# EAGLE design pid driver (EAGLE 9.5.1)

## Sheet 1 of 2
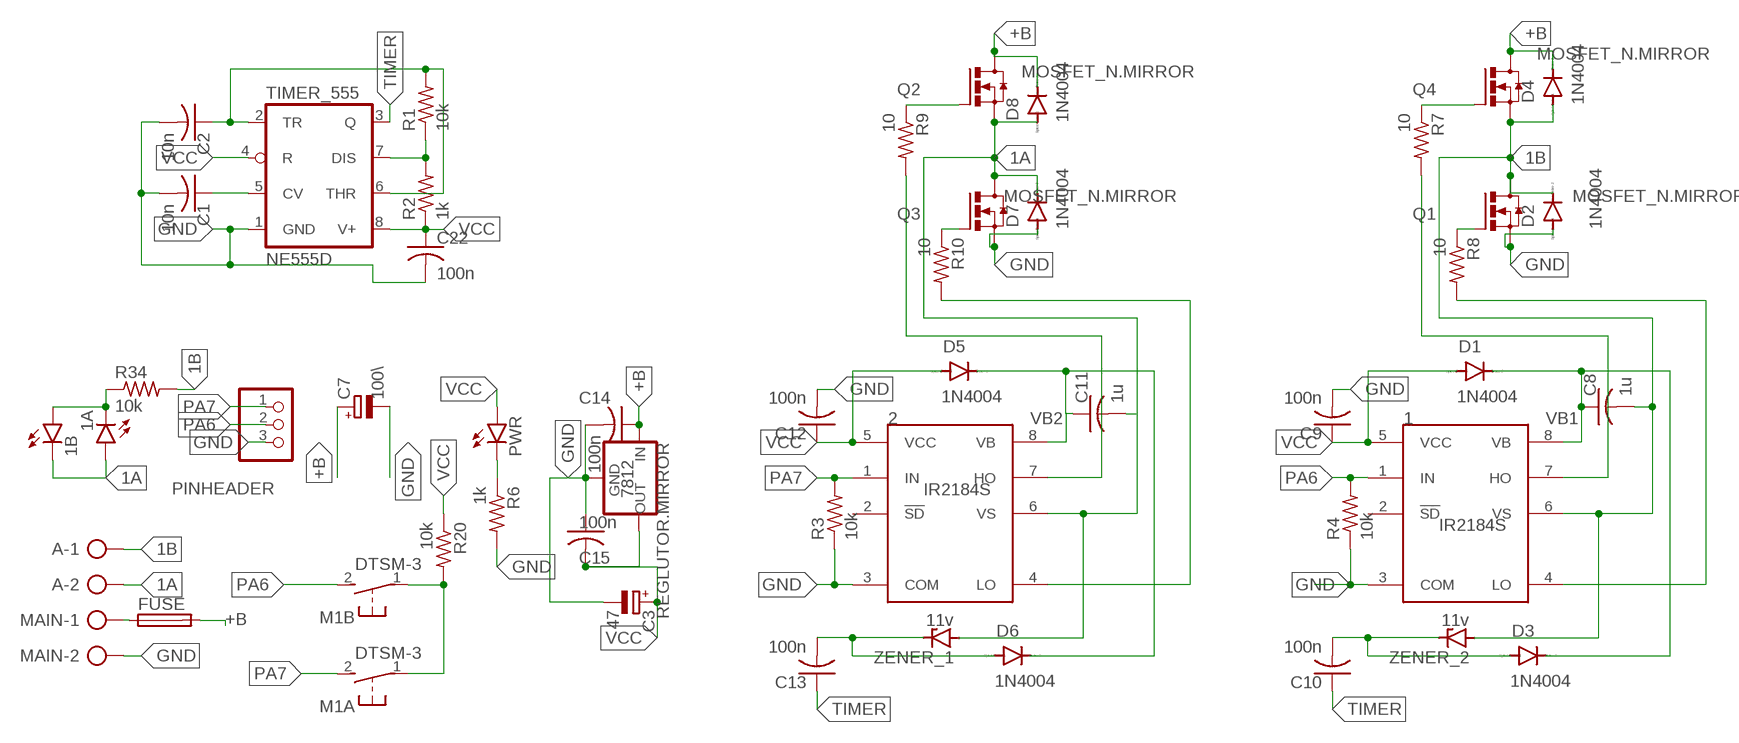
[diagram p0: schematic, sheet 1]

### Parts
1  IR2184S  [SO08]
1A  LEDCHIPLED_1206  [CHIPLED_1206]
1B  LEDCHIPLED_1206  [CHIPLED_1206]
2  IR2184S  [SO08]
7812  REGLUTOR.MIRROR  [78XXL.MIRROR]
A  AK300/22  [XTALRR488W60L1090T465H350B]
C1  10n  C-USC1206K  [C1206K]
C2  10n  C-USC1206K  [C1206K]
C3  47  CPOL-EUE5-10.5  [E5-10,5]
C7  100\  CPOL-EUE5-10.5  [E5-10,5]
C8  1u  C-USC1206K  [C1206K]
C9  100n  C-USC1206K  [C1206K]
C10  100n  C-USC1206K  [C1206K]
C11  1u  C-USC1206K  [C1206K]
C12  100n  C-USC1206K  [C1206K]
C13  100n  C-USC1206K  [C1206K]
C14  100n  C-USC1206K  [C1206K]
C15  100n  C-USC1206K  [C1206K]
C22  100n  C-USC1206K  [C1206K]
D1  1N4004  [DO41-10]
D2  1N4004  [DO41-10]
D3  1N4004  [DO41-10]
D4  1N4004  [DO41-10]
D5  1N4004  [DO41-10]
D6  1N4004  [DO41-10]
D7  1N4004  [DO41-10]
D8  1N4004  [DO41-10]
FUSE  FUSE_HOLDER  [SH22,5A]
M1A  DTSM-3  [DTSM-3]
M1B  DTSM-3  [DTSM-3]
MAIN  AK300/22  [XTALRR488W60L1090T465H350B]
PINHEADER  PINHD-1X3  [1X03]
PWR  LEDCHIPLED_1206  [CHIPLED_1206]
Q1  MOSFET_N.MIRROR  [TO220.MIRROR]
Q2  MOSFET_N.MIRROR  [TO220.MIRROR]
Q3  MOSFET_N.MIRROR  [TO220.MIRROR]
Q4  MOSFET_N.MIRROR  [TO220.MIRROR]
R1  10k  R-US_M1206  [M1206]
R2  1k  R-US_M1206  [M1206]
R3  10k  R-US_M1206  [M1206]
R4  10k  R-US_M1206  [M1206]
R6  1k  R-US_M1206  [M1206]
R7  10  R-US_M1206  [M1206]
R8  10  R-US_M1206  [M1206]
R9  10  R-US_M1206  [M1206]
R10  10  R-US_M1206  [M1206]
R20  10k  R-US_M1206  [M1206]
R34  10k  R-US_M1206  [M1206]
TIMER_555  NE555D  [SO08]
ZENER_1  11v  BZD23  [SOD81]
ZENER_2  11v  BZD23  [SOD81]

### Nets
1A: 1A.A 1B.C 2.6(VS) A.2 C11.2 D7.C D8.A Q2.S Q3.D ZENER_1.A
1B: 1.6(VS) A.1 C8.2 D2.C D4.A Q1.D Q4.S R34.2 ZENER_2.A
+B: 7812.IN C7.+ C14.1 D4.C D8.C FUSE.2 Q2.D Q4.D
GND: 1.3(COM) 2.3(COM) 7812.GND C1.2 C2.2 C3.- C7.- C9.2 C12.2 C14.2 C15.1 C22.2 D2.A D7.A MAIN.2 PINHEADER.3 Q1.S Q3.S R3.1 R4.1 R6.2 TIMER_555.1(GND) ; also sheet 2
N$1: PWR.C R6.1
N$2: C1.1 TIMER_555.5(CV)
N$3: R1.1 R2.2 TIMER_555.7(DIS)
N$4: C2.1 R1.2 TIMER_555.2(TR) TIMER_555.6(THR)
N$7: M1A.1 M1B.1 R20.2
N$9: Q4.G R7.1
N$10: Q1.G R8.1
N$12: 1.4(LO) R8.2
N$13: 1.7(HO) R7.2
N$14: C10.2 D3.A ZENER_2.C
N$15: Q3.G R10.1
N$16: Q2.G R9.1
N$17: 2.4(LO) R10.2
N$18: 2.7(HO) R9.2
N$20: C13.2 D6.A ZENER_1.C
N$22: FUSE.1 MAIN.1
N$45: 1A.C 1B.A R34.1
PA6: 1.1(IN) M1B.2 PINHEADER.2 R4.2
PA7: 2.1(IN) M1A.2 PINHEADER.1 R3.2
TIMER: C10.1 C13.1 TIMER_555.3(Q)
VB1: 1.8(VB) C8.1 D1.C D3.C
VB2: 2.8(VB) C11.1 D5.C D6.C
VCC: 1.5(VCC) 2.5(VCC) 7812.OUT C3.+ C9.1 C12.1 C15.2 C22.1 D1.A D5.A PWR.A R2.1 R20.1 TIMER_555.4(R) TIMER_555.8(V+)
Unconnected: 1.2(!SD) 2.2(!SD)

## Sheet 2 of 2
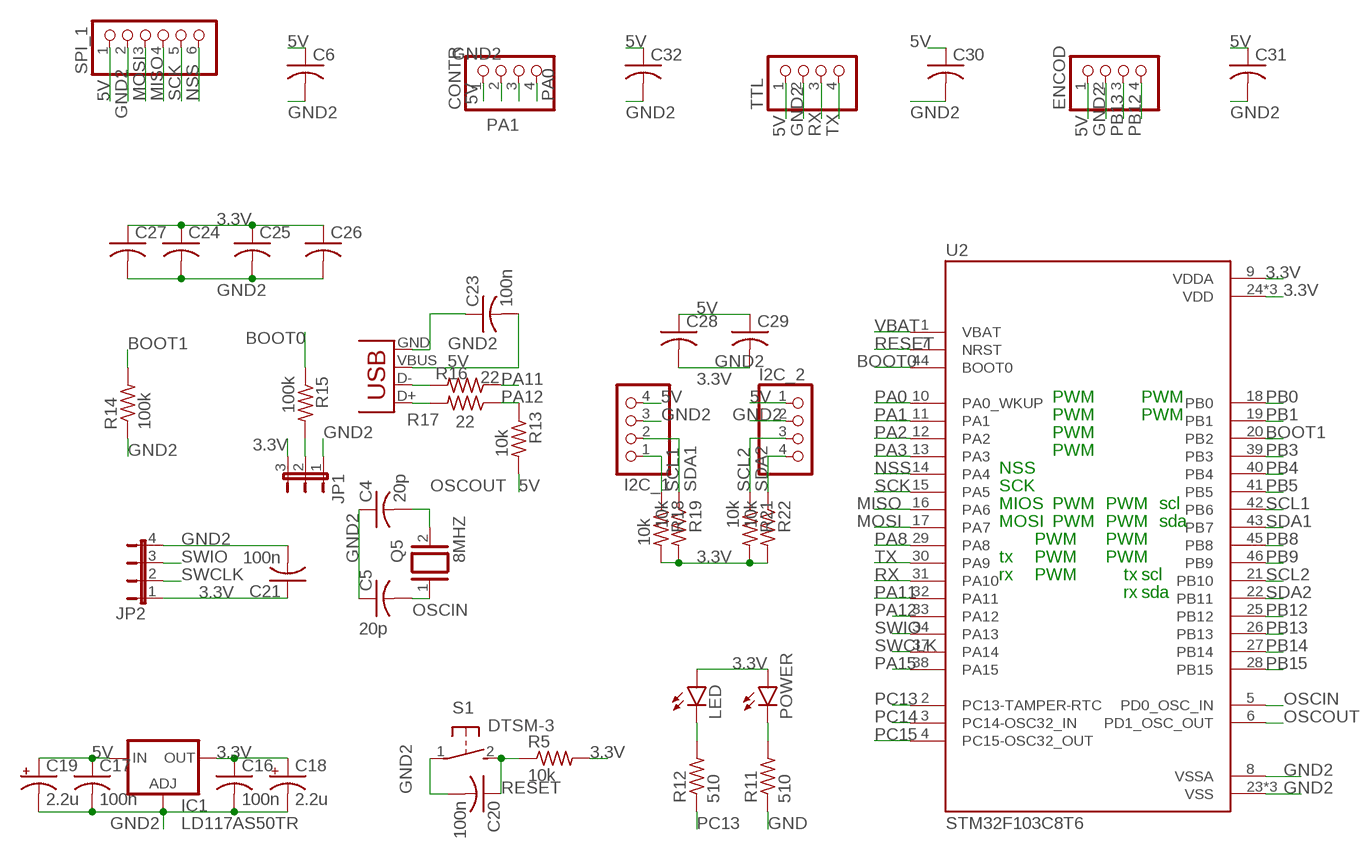
[diagram p1: schematic, sheet 2]

### Parts
C4  20p  C-USC1206  [C1206]
C5  20p  C-USC1206  [C1206]
C6  C-USC1206  [C1206]
C16  100n  C-USC1206  [C1206]
C17  100n  C-USC1206  [C1206]
C18  2.2u  CPOL-USE2-5  [E2-5]
C19  2.2u  CPOL-USE2-5  [E2-5]
C20  100n  C-USC1206  [C1206]
C21  100n  C-USC1206  [C1206]
C23  100n  C-USC1206  [C1206]
C24  C-USC1206  [C1206]
C25  C-USC1206  [C1206]
C26  C-USC1206  [C1206]
C27  C-USC1206  [C1206]
C28  C-USC1206  [C1206]
C29  C-USC1206  [C1206]
C30  C-USC1206  [C1206]
C31  C-USC1206  [C1206]
C32  C-USC1206  [C1206]
CONTR  PINHD-1X4  [1X04]
ENCOD  PINHD-1X4  [1X04]
I2C_1  PINHD-1X4  [1X04]
I2C_2  PINHD-1X4  [1X04]
IC1  LD117AS50TR  [SOT223]
JP1  JP2E  [JP2]
JP2  JP4E  [JP4]
LED  LEDCHIPLED_1206  [CHIPLED_1206]
POWER  LEDCHIPLED_1206  [CHIPLED_1206]
Q5  8MHZ  XTAL/S  [QS]
R5  10k  R-US_R1206  [R1206]
R11  510  R-US_R1206  [R1206]
R12  510  R-US_R1206  [R1206]
R13  10k  R-US_R1206  [R1206]
R14  100k  R-US_R1206  [R1206]
R15  100k  R-US_R1206  [R1206]
R16  22  R-US_R1206  [R1206]
R17  22  R-US_R1206  [R1206]
R18  10k  R-US_R1206  [R1206]
R19  10k  R-US_R1206  [R1206]
R21  10k  R-US_R1206  [R1206]
R22  10k  R-US_R1206  [R1206]
S1  DTSM-3  [DTSM-3]
SPI_1  PINHD-1X6  [1X06]
TTL  PINHD-1X4  [1X04]
U2  STM32F103C8T6  [QFP50P900X900X160-48N]
X1  USB-MB-S  [USB-MB-S]

### Nets
3.3V: C16.1 C18.+ C21.1 C24.1 C25.1 C26.1 C27.1 IC1.4(OUT) JP1.3 JP2.1 LED.A POWER.A R5.2 R18.2 R19.2 R21.2 R22.2 U2.9(VDDA) U2.24(VDD) U2.36(VDD) U2.48(VDD)
5V: C6.1 C17.1 C19.+ C23.2 C28.1 C29.1 C30.1 C31.1 C32.1 CONTR.1 ENCOD.1 I2C_1.4 I2C_2.1 IC1.3(IN) R13.2 SPI_1.1 TTL.1 X1.VBUS
BOOT0: R15.1 U2.44(BOOT0)
BOOT1: R14.2 U2.20(PB2)
GND: R11.1 ; also sheet 1
GND2: C4.1 C5.1 C6.2 C16.2 C17.2 C18.- C19.- C20.2 C21.2 C23.1 C24.2 C25.2 C26.2 C27.2 C28.2 C29.2 C30.2 C31.2 C32.2 CONTR.2 ENCOD.2 I2C_1.3 I2C_2.2 IC1.1(ADJ) JP1.1 JP2.4 R14.1 S1.1 SPI_1.2 TTL.2 U2.8(VSSA) U2.23(VSS) U2.35(VSS) U2.47(VSS) X1.GND
MISO: SPI_1.4 U2.16(PA6)
MOSI: SPI_1.3 U2.17(PA7)
N$5: LED.C R12.2
N$6: POWER.C R11.2
N$8: JP1.2 R15.2
N$19: R16.2 X1.D-
N$21: R17.2 X1.D+
NSS: SPI_1.6 U2.14(PA4)
OSCIN: C5.2 Q5.1 U2.5(PD0_OSC_IN)
OSCOUT: C4.2 Q5.2 U2.6(PD1_OSC_OUT)
PA0: CONTR.4 U2.10(PA0_WKUP)
PA1: CONTR.3 U2.11(PA1)
PA2: U2.12(PA2)
PA3: U2.13(PA3)
PA8: U2.29(PA8)
PA11: R16.1 U2.32(PA11)
PA12: R13.1 R17.1 U2.33(PA12)
PA15: U2.38(PA15)
PB0: U2.18(PB0)
PB1: U2.19(PB1)
PB3: U2.39(PB3)
PB4: U2.40(PB4)
PB5: U2.41(PB5)
PB8: U2.45(PB8)
PB9: U2.46(PB9)
PB12: ENCOD.4 U2.25(PB12)
PB13: ENCOD.3 U2.26(PB13)
PB14: U2.27(PB14)
PB15: U2.28(PB15)
PC13: R12.1 U2.2(PC13-TAMPER-RTC)
PC14: U2.3(PC14-OSC32_IN)
PC15: U2.4(PC15-OSC32_OUT)
RESET: C20.1 R5.1 S1.2 U2.7(NRST)
RX: TTL.3 U2.31(PA10)
SCK: SPI_1.5 U2.15(PA5)
SCL1: I2C_1.1 R18.1 U2.42(PB6)
SCL2: I2C_2.3 R21.1 U2.21(PB10)
SDA1: I2C_1.2 R19.1 U2.43(PB7)
SDA2: I2C_2.4 R22.1 U2.22(PB11)
SWCLK: JP2.2 U2.37(PA14)
SWIO: JP2.3 U2.34(PA13)
TX: TTL.4 U2.30(PA9)
VBAT: U2.1(VBAT)

### Notes on the sheet
- PWM | PWM
- PWM | PWM
- PWM
- PWM
- NSS
- SCK
- MIOS | PWM | PWM | scl
- MOSI | PWM | PWM | sda
- PWM | PWM
- tx | PWM | PWM
- rx | PWM | tx | scl
- rx | sda

## Library data of the parts
1 2 = irs:IR2184
1A 1B LED POWER PWR = led:LED: LED OSRAM: - CHIPLED LG R971, LG N971, LY N971, LG Q971, LY Q971, LO R971, LY R971 LH N974, LH R974 LS Q976, LO Q976, LY Q976 LO Q996 - Hyper CHIPLED LW Q18S LB Q993, LB Q99A, LB R99A - SideLED LS A670, LO A670, LY A670, LG A670, LP A670 LB A673, LV A673, LT A673, LW A673 LH A674 LY A675 LS A676, LA A676, LO A676, LY A676, LW A676 LS A679, LY A679, LG A679 - Hyper Micro SIDELED® LS Y876, LA Y876, LO Y876, LY Y876 LT Y87S - SmartLED LW L88C, LW L88S LB L89C, LB L89S, LG L890 LS L89K, LO L89K, LY L89K LS L896, LA L896, LO L896, LY L896 - TOPLED LS T670, LO T670, LY T670, LG T670, LP T670 LSG T670, LSP T670, LSY T670, LOP T670, LYG T670 LG T671, LOG T671, LSG T671 LB T673, LV T673, LT T673, LW T673 LH T674 LS T676, LA T676, LO T676, LY T676, LB T676, LH T676, LSB T676, LW T676 LB T67C, LV T67C, LT T67C, LS T67K, LO T67K, LY T67K, LW E67C LS E67B, LA E67B, LO E67B, LY E67B, LB E67C, LV E67C, LT E67C LW T67C LS T679, LY T679, LG T679 LS T770, LO T770, LY T770, LG T770, LP T770 LB T773, LV T773, LT T773, LW T773 LH T774 LS E675, LA E675, LY E675, LS T675 LS T776, LA T776, LO T776, LY T776, LB T776 LHGB T686 LT T68C, LB T68C - Hyper Mini TOPLED® LB M676 - Mini TOPLED Santana® LG M470 LS M47K, LO M47K, LY M47K Source: http://www.osram.convergy.de LUXEON: - LUMILED® LXK2-PW12-R00, LXK2-PW12-S00, LXK2-PW14-U00, LXK2-PW14-V00 LXK2-PM12-R00, LXK2-PM12-S00, LXK2-PM14-U00 LXK2-PE12-Q00, LXK2-PE12-R00, LXK2-PE12-S00, LXK2-PE14-T00, LXK2-PE14-U00 LXK2-PB12-K00, LXK2-PB12-L00, LXK2-PB12-M00, LXK2-PB14-N00, LXK2-PB14-P00, LXK2-PB14-Q00 LXK2-PR12-L00, LXK2-PR12-M00, LXK2-PR14-Q00, LXK2-PR14-R00 LXK2-PD12-Q00, LXK2-PD12-R00, LXK2-PD12-S00 LXK2-PH12-R00, LXK2-PH12-S00 LXK2-PL12-P00, LXK2-PL12-Q00, LXK2-PL12-R00 Source: www.luxeon.com KINGBRIGHT: KA-3528ASYC Source: www.kingbright.com
7812 = MOSFET MIRROR:REGLUTOR.MIRROR
A MAIN = con-ptr50056:AK300/2: CONNECTOR
C1 C2 C4-C6 C8-C17 C20-C32 = rcl:C-US: CAPACITOR, American symbol; SPICEPREFIX: C
C3 C7 = rcl8:CPOL-EU: POLARIZED CAPACITOR, European symbol; SPICEPREFIX: C
C18 C19 = rcl:CPOL-US: POLARIZED CAPACITOR, American symbol; SPICEPREFIX: C
CONTR ENCOD TTL = MIA_LIBRARY (2):PINHD-1X4: PIN HEADER
D1-D8 = diode:1N4004: DIODE general purpose rectifier, 1 A
FUSE = MIA_LIBRARY (2):FUSE_HOLDER
I2C_1 I2C_2 = pinhead:PINHD-1X4: PIN HEADER
IC1 = v-reg:LD117A?*: Low drop fixed and adjustable positive voltage regulators 1 A Source: http://www.st.com/stonline/products/literature/ds/7194/ld1117axx.pdf
JP1 = jumper:JP2E: JUMPER
JP2 = jumper:JP4E: JUMPER
M1A M1B S1 = switch-tact:DTSM-3
PINHEADER = pinhead:PINHD-1X3: PIN HEADER
Q1-Q4 = MIA_LIBRARY (1):MOSFET_N.MIRROR
Q5 = special:XTAL/S: CRYSTAL
R1-R22 R34 = rcl:R-US_: RESISTOR, American symbol; SPICEPREFIX: R
SPI_1 = pinhead:PINHD-1X6: PIN HEADER
TIMER_555 = linear:*555: TIMER
U2 = STM32F103C8T6:STM32F103C8T6: Mainstream Performance line, ARM Cortex-M3 MCU with 64 Kbytes Flash, 72 MHz CPU, motor control, USB and CAN; AVAILABILITY: Unavailable; DESCRIPTION: Mainstream Performance line, ARM Cortex-M3 MCU with 64 Kbytes Flash, 72 MHz CPU, motor control, USB and CAN; MF: STMicroelectronics; MP: STM32F103C8T6; PACKAGE: LQFP-48 STMicroelectronics; PRICE: None
X1 = MIA_LIBRARY (2):USB: USB Connectors
ZENER_1 ZENER_2 = diode:BZD23: Z DIODE

## Board
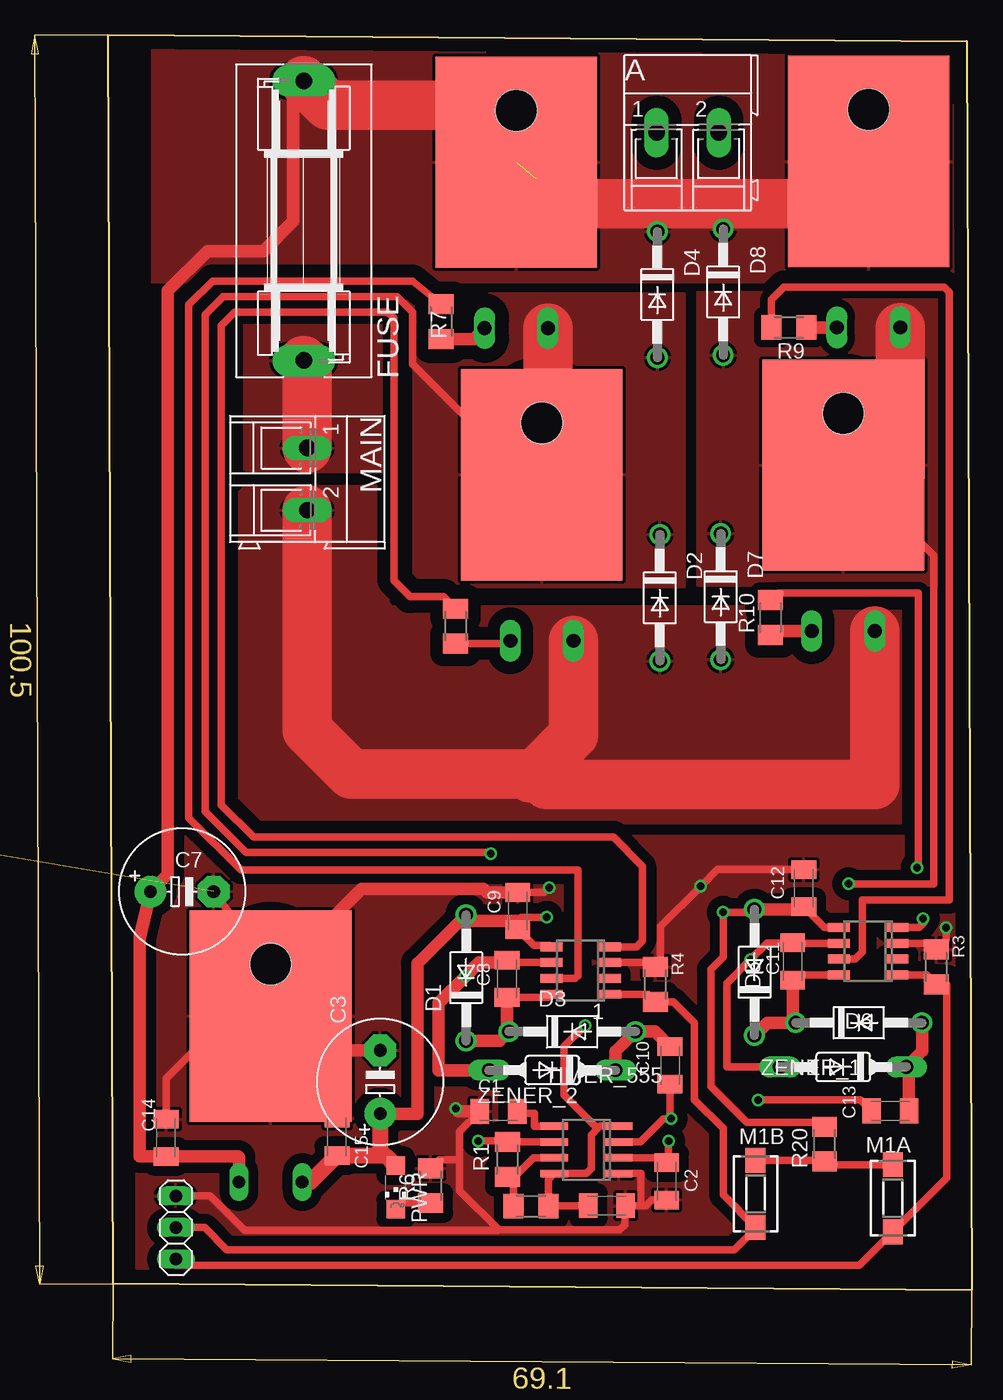
[diagram p2: board, top side]
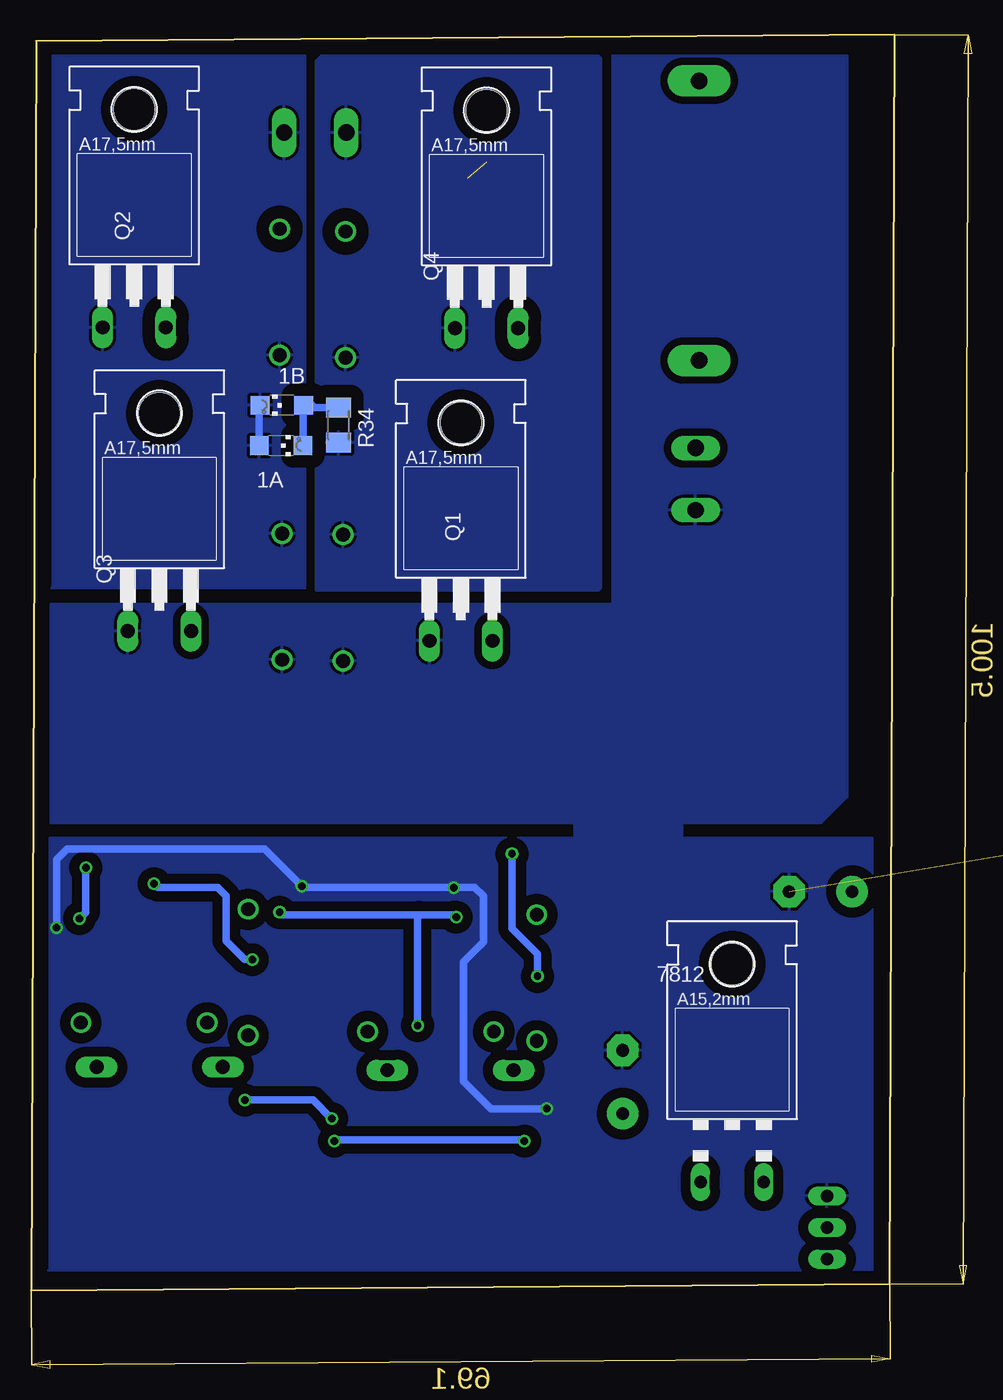
[diagram p3: board, bottom side, seen from below]

Size 69.5 x 101 mm. Coordinates in mm from the lower left corner, seen from the top.
Outline: 0.4,0.5 0,101 69.1,100.5 69.5,0 0.4,0.5
Copper layers (1*16): Top 0.035mm / dielectric 1.5mm / Bottom 0.035mm
Design rules "default *": minimum track width 0.015240625mm, minimum drill 0.8mm, track to track 0.6mm, track to pad 0.6mm, pad to pad 0.4mm, via to via 6mil, smd to smd 6mil, copper to edge 40mil, drill to drill 6mil, minimum pad ring 10mil, minimum via ring 8mil, stop-mask expansion 4mil, vias tented up to drill 0mil, thermal gap 10mil

### Footprints (pad centres in the part's own frame; a part is rotated, then mirrored left to right if it is on the bottom)
SO08 = smd 0.72 x 1.78: 1 -1.905,-2.35; 2 -0.635,-2.35; 3 0.635,-2.35; 4 1.905,-2.35; 5 1.905,2.35; 6 0.635,2.35; 7 -0.635,2.35; 8 -1.905,2.35
CHIPLED_1206 = smd 1.5 x 1.5: A 0,-1.75; C 0,1.75
78XXL.MIRROR = smd 13 x 17 bottom: GND 0,7 | drill 1.016 long: IN 2.54,-6.35; OUT -2.54,-6.35 | hole 3.302: 0,11.176
XTALRR488W60L1090T465H350B = drill 1.321 long: 1 -2.515,-1.27; 2 2.489,-1.27
C1206K = smd 1.5 x 2: 1 -1.5,0; 2 1.5,0
E5-10,5 = drill 1.016 pad 2.54: + -2.54,0 | drill 1.016 pad 2.54 octagon: - 2.54,0
C1206 = smd 1.6 x 1.8: 1 -1.4,0; 2 1.4,0
E2-5 = drill 0.813 pad 1.27: + -1.016,0 | drill 0.813 pad 1.27 octagon: - 1.016,0
1X04 = drill 1.016 long: 1 -3.81,0; 2 -1.27,0; 3 1.27,0; 4 3.81,0
DO41-10 = drill 1.118: A 5.08,0; C -5.08,0
SH22,5A = drill 1.321 pad 2.54 long: 1 -11.252,0; 2 11.252,0
SOT223 = smd 1.5 x 2: 1 -2.3,-3.15; 2 0,-3.15; 3 2.3,-3.15 | smd 3.8 x 2: 4 0,3.15
JP2 = drill 0.914 long: 1 -2.54,0; 2 0,0; 3 2.54,0
JP4 = drill 0.914 long: 1 -3.81,0; 2 -1.27,0; 3 1.27,0; 4 3.81,0
DTSM-3 = smd 2 x 1.6: 1 -2.7,0; 2 2.7,0
1X03 = drill 1.016 long: 1 -2.54,0; 2 0,0; 3 2.54,0
TO220.MIRROR = smd 13 x 17 bottom: D 0,7 | drill 1.118 long: G 2.54,-6.35; S -2.54,-6.35 | hole 3.302: 0,11.176
QS = drill 0.61 long: 1 -2.54,0; 2 2.54,0
M1206 = smd 1.6 x 2: 1 -1.4,0; 2 1.4,0
R1206 = smd 1.6 x 1.803: 1 -1.422,0; 2 1.422,0
1X06 = drill 1.016 long: 1 -6.35,0; 2 -3.81,0; 3 -1.27,0; 4 1.27,0; 5 3.81,0; 6 6.35,0
SO08' = smd 0.6 x 2.2: 1 -1.905,-2.6; 2 -0.635,-2.6; 3 0.635,-2.6; 4 1.905,-2.6; 5 1.905,2.6; 6 0.635,2.6; 7 -0.635,2.6; 8 -1.905,2.6
QFP50P900X900X160-48N = smd 1.56 x 0.28: 1 -4.18,2.75; 2 -4.18,2.25; 3 -4.18,1.75; 4 -4.18,1.25; 5 -4.18,0.75; 6 -4.18,0.25; 7 -4.18,-0.25; 8 -4.18,-0.75; 9 -4.18,-1.25; 10 -4.18,-1.75; 11 -4.18,-2.25; 12 -4.18,-2.75; 25 4.18,-2.75; 26 4.18,-2.25; 27 4.18,-1.75; 28 4.18,-1.25; 29 4.18,-0.75; 30 4.18,-0.25; 31 4.18,0.25; 32 4.18,0.75; 33 4.18,1.25; 34 4.18,1.75; 35 4.18,2.25; 36 4.18,2.75 | smd 0.28 x 1.56: 13 -2.75,-4.18; 14 -2.25,-4.18; 15 -1.75,-4.18; 16 -1.25,-4.18; 17 -0.75,-4.18; 18 -0.25,-4.18; 19 0.25,-4.18; 20 0.75,-4.18; 21 1.25,-4.18; 22 1.75,-4.18; 23 2.25,-4.18; 24 2.75,-4.18; 37 2.75,4.18; 38 2.25,4.18; 39 1.75,4.18; 40 1.25,4.18; 41 0.75,4.18; 42 0.25,4.18; 43 -0.25,4.18; 44 -0.75,4.18; 45 -1.25,4.18; 46 -1.75,4.18; 47 -2.25,4.18; 48 -2.75,4.18
USB-MB-S = smd 2.5 x 0.5: D+ 2.5,0; D- 2.5,0.8; GND 2.5,-1.6; ID 2.5,-0.8; VBUS 2.5,1.6 | smd 2.5 x 2: P$1 -3,-4.5; P$2 -3,4.5; P$3 2.5,-4.4; P$4 2.5,4.5 | drill 0.9: P$5 0,2.2; P$6 0,-2.2
SOD81 = drill 1.118 long: A 5.08,0; C -5.08,0

### Placement (x,y rotation side)
1  38.02,25.72 90 top
1A  49.38,67.95 270 bottom
1B  49.32,71.2 90 bottom
2  61.16,27.28 90 top
7812  13.08,15.05 0 bottom
A  46.65,94.4 0 top
C1  31.42,14.4 180 top
C2  44.95,8.75 270 top
C3  21.9,16.75 90 top
C4  -44.6,84.4 0 top  (outside the outline)
C5  -44.6,80.2 0 top  (outside the outline)
C6  -110.3,-12.4 0 top  (outside the outline)
C7  5.96,32.07 0 top
C8  32.11,25.05 90 top
C9  32.97,30.5 90 top
C10  45.22,18.09 90 top
C11  55.09,26.45 90 top
C12  55.98,32.34 90 top
C13  62.95,14.42 0 top
C14  4.67,12.26 90 top
C15  18.42,12.34 270 top
C16  -52.9,74 0 top  (outside the outline)
C17  -52.9,69.8 0 top  (outside the outline)
C18  -52.7,65.9 0 top  (outside the outline)
C19  -52.7,60.4 0 top  (outside the outline)
C20  -61.5,50.4 0 top  (outside the outline)
C21  -83,64 0 top  (outside the outline)
C22  40.15,6.8 0 top
C23  -101.2,54 0 top  (outside the outline)
C24  -101.2,47.8 0 top  (outside the outline)
C25  -101.2,43.6 0 top  (outside the outline)
C26  -101.2,39.4 0 top  (outside the outline)
C27  -101.2,35.2 0 top  (outside the outline)
C28  -102.3,31 0 top  (outside the outline)
C29  -102.3,26.8 0 top  (outside the outline)
C30  -102.3,17.2 0 top  (outside the outline)
C31  -102.3,7.6 0 top  (outside the outline)
C32  -34.4,67 0 top  (outside the outline)
CONTR  -99.1,2.9 0 top  (outside the outline)
D1  28.81,25.13 90 top
D2  44.4,55.7 270 top
D3  37.35,20.8 0 top
D4  44.2,80.1 270 top
D5  52.02,25.57 90 top
D6  60.41,21.52 0 top
D7  49.3,55.8 270 top
D8  49.5,80.3 270 top
ENCOD  -99.1,12.5 0 top  (outside the outline)
FUSE  15.75,86.05 90 top
I2C_1  -107.1,-22.5 0 top  (outside the outline)
I2C_2  -107.1,-17.1 0 top  (outside the outline)
IC1  -52,81.5 0 top  (outside the outline)
JP1  -108.8,1.1 0 top  (outside the outline)
JP2  -82.2,74.9 0 top  (outside the outline)
LED  -74.9,12.2 0 top  (outside the outline)
M1A  63.15,7.4 270 top
M1B  52.1,7.75 270 top
MAIN  17.3,65.25 270 top
PINHEADER  5.46,5.04 90 top
POWER  -81.1,12.2 0 top  (outside the outline)
PWR  23.15,8.26 180 top
Q1  34.91,58.6 0 bottom
Q2  61.2,83.81 0 bottom
Q3  59.17,59.38 0 bottom
Q4  32.85,83.75 0 bottom
Q5  -41.3,89.9 0 top  (outside the outline)
R1  32.13,10.52 90 top
R2  34.03,6.76 180 top
R3  66.65,26 270 top
R4  44.05,24.6 270 top
R5  -61.5,54.6 0 top  (outside the outline)
R6  25.96,8.41 90 top
R7  26.81,77.92 90 top
R8  27.96,53.42 90 top
R9  54.79,77.46 180.1 top
R10  53.3,54.11 90 top
R11  -61.5,44.2 0 top  (outside the outline)
R12  -61.5,40 0 top  (outside the outline)
R13  -61.5,35.8 0 top  (outside the outline)
R14  -61.5,31.6 0 top  (outside the outline)
R15  -61.5,27.4 0 top  (outside the outline)
R16  -61.5,23.2 0 top  (outside the outline)
R17  -61.5,19 0 top  (outside the outline)
R18  -61.5,14.8 0 top  (outside the outline)
R19  -61.5,10.6 0 top  (outside the outline)
R20  57.66,11.75 270 top
R21  -101.2,62.4 0 top  (outside the outline)
R22  -101.2,58.2 0 top  (outside the outline)
R34  44.75,69.6 270 bottom
S1  -60.2,62.1 0 top  (outside the outline)
SPI_1  -104.6,-7.5 0 top  (outside the outline)
TIMER_555  NE555D  [SO08']  38.5,11.29 90 top
TTL  -99.1,22.1 0 top  (outside the outline)
U2  -42.9,50.7 0 top  (outside the outline)
X1  -81.8,84 0 top  (outside the outline)
ZENER_1  59.15,17.95 180 top
ZENER_2  35.75,17.7 180 top

### Tracks (layer width: path | path; a pad name or v marks a point on that pad's centre or on a via)
1A  (via drill 0.6)
  Top 0.61: 2.6 55.13,27.91 C11.2 53.05,27.95 v51.7,26.6 49.8,24.7 49.8,17.95 ZENER_1.A | 61.2,66 61.2,64.35 61.2,59.2 | Q3.D 66.45,59.1 66.45,32.7 v59.6,32.7
  Top 4: 61.2,63 63.6,63 63.6,65.6 63.5,65.7 61.1,65.7 61.1,64.2 61.7,63.6 61.9,63.6 61.9,63.9 59.9,63.9 59.9,62.9 58.9,62.9 58.7,62.7 58.7,62.4 60.4,60.7 62.3,60.7 62.3,66 61.2,66 | 61.2,64.35 Q3.D 57.9,65.11 57.9,61.8 | 61.2,66.1 61.2,63 | Q2.S 63.74,65.54 61.2,63
  Bottom 0.6: 1A.A 51.13,71.14 1B.C
  Bottom 0.61: v59.6,32.7 59.3,32.4 54.5,32.4 53.8,31.7 53.8,28.1 52.3,26.6 v51.7,26.6
  pour Top (isolate 0.61): 68.8,80.3 47.4,80.3 47.4,56.7 68.8,56.7
  pour Bottom (isolate 1.016): 47.4,56.5 47.4,99.3 67.8,99.3 67.8,56.6 67.9,56.5
1B  (via drill 0.6)
  Top 0.61: 1.6 32.3,26.36 C8.2 | Q1.D 33.41,65.6 24.5,74.51 24.5,78.7 23.25,79.95 9.25,79.95 7.8,78.5 7.8,38.5 11.1,35.2 30.8,35.2 v30.8,35.1
  Top 1.016: ZENER_2.A 26.6,17.7 26.6,23.1 v28.75,25.25 29.86,26.36 32.3,26.36
  Top 4: Q4.S 35.39,66.89 32.9,64.4 32.7,64.6 32.7,65.6 | Q1.D 32.7,65.6 | 32.7,66.3 32.7,65.6
  Bottom 0.61: v28.75,25.25 28.75,27.05 30.8,29.1 v30.8,35.1
  pour Top (isolate 1.13): 46.4,80.2 46.4,56.55 23.85,56.55 23.8,56.5 23.8,80.1 23.7,80.2
  pour Bottom (isolate 1.016): 46.6,56.3 23.8,56.3 23.6,56.5 23.6,99.1 23.8,99.3 46.2,99.3 46.4,99.1 46.6,98.9
3.3V  (20 unrouted)
5V  (17 unrouted)
+B  (1 unrouted)
  Top 1.016: 7812.IN 10.54,10.69 10.47,10.76 C14.1 2.53,10.76 2.53,28.33 C7.+ 4.8,33.45 4.8,80.4 8,83.6 12.5,83.6 14.9,86 14.9,96.45 FUSE.2
  Top 4: 34.8,89.44 35.87,89.44 35.9,89.4 35.9,86.7 34.5,85.3 32.4,87.4 34.43,89.44 | FUSE.2 17.7,95.35 31.62,95.35 37.17,89.8 31.97,89.8 | 31.97,89.8 31.3,89.8 33.71,87.39 57.79,87.39 Q2.D | 31.97,89.8 32.34,89.44
  pour Top (isolate 1.016): 3.5,100 3.5,81.1 68.4,81.1 68.4,99.9 68.3,100
BOOT0  (1 unrouted)
BOOT1  (1 unrouted)
GND  (via drill 0.6)  (1 unrouted)
  Top 0.6: C1.2 28.3,12.78 28.3,10.5 28.3,8 31.45,4.85 41.15,4.85 41.57,5.28 41.57,6.88 41.57,6.97 | TIMER_555.1 42.9,9.38 42.9,6.8 C22.2 | C2.2 43.75,7.25 43.3,6.8
  Top 0.61: 2.3 66.13,27.91 R3.1 67.45,28.2 v67.45,29.15 | 1.3 43.7,26.36 R4.1 44.45,26.4 44.45,29.25 v47.7,32.5 49.04,33.84 C12.2 | v35.5,32.4 35.1,32 C9.2 | 41.6,6.95 41.57,6.97 | 41.57,6.88 C22.2 43.3,6.8 | R6.2 26.65,10.5 28.3,10.5 | 20.4,32.3 13.08,24.98 7812.GND 13.08,25.76 C7.- | 11.27,23.64 4.67,17.04 C14.2 | PINHEADER.3 8.22,7.58 11,4.8 31.4,4.8 31.45,4.85
  Top 1.016: C1.2 28.2,14.4 v28,14.6 | 7812.GND 15.84,19.29 16.44,19.29 | 16.44,19.29 18.42,17.31 C15.1 | C3.- 16.44,19.29 | C9.2 30.5,32 30.2,32.3 20.4,32.3 11.73,23.64 11.27,23.64
  Top 4: Q1.S 37.45,44.65 34.35,41.55 | 34.35,41.55 34.25,41.45 | 34.25,41.45 34,41.2 | Q3.S 61.71,40.7 35.3,40.7 34.55,41.45 34.25,41.45 | MAIN.2 16.03,45.07 19.55,41.55 34.35,41.55
  Bottom 0.61: v67.45,29.15 67.45,34.65 66.6,35.5 50.7,35.5 v47.7,32.5 47.6,32.4 v35.5,32.4 33.8,32.4 33.1,31.7 33.1,28 34.7,26.4 34.7,16.8 32.5,14.6 v28,14.6
  pour Top (isolate 1.016): 67.6,54.6 67.2,55 22.9,55 22.6,55.3 22.6,64.4 22.3,64.7 11,64.7 9,62.7 9,39.9 11.3,37.6 68.9,37.6 68.9,53.6 67.9,54.6
  pour Bottom: 67.9,55.2 67.9,37.6 5.9,37.6 3.8,39.7 3.8,99.3 22.7,99.3 22.7,55.2
  pour Bottom (isolate 0.813): 68,36.4 68,1.7 68.1,1.6 1.8,1.6 1.8,36.4
  pour Bottom: 11.2,64.5 21.2,64.5 21.7,64 21.7,52.1 25.8,48 25.8,19.4 24.2,17.8 18.2,17.8 17.1,18.9 17.1,43.4 11.2,49.3
  pour Top (isolate 0.813): 68,1.7 2.3,1.7 2.3,36.6 68,36.6 68.1,36.5 68.1,1.8
GND2  (34 unrouted)
MISO  (1 unrouted)
MOSI  (1 unrouted)
N$1
  Top 0.61: R6.1 23.65,7.01 PWR.C
N$2
  Top 0.61: C1.1 33.1,14.22 34.3,14.22 34.3,13.2 TIMER_555.5
N$3
  Top 0.61: TIMER_555.7 34.26,10.65 32.72,9.12 R1.1 32.63,8.62 R2.2
N$4  (via drill 0.6)
  Top 0.6: v45.1,12 45.1,10.4 C2.1 | v29.8,12 32.06,12 R1.2
  Top 0.61: C2.1 44.54,10.65 TIMER_555.2 | 32.19,11.86 R1.2 TIMER_555.6
  Bottom 0.6: v29.8,12 29.9,12.1 45,12.1 v45.1,12
N$5  (1 unrouted)
N$6  (1 unrouted)
N$7
  Top 0.61: M1B.1 58.15,10.45 58.2,10.5 57.81,10.5 | 57.81,10.5 R20.2 | M1A.1 58.21,10.1 57.81,10.5
N$8  (1 unrouted)
N$9
  Top 1.016: Q4.G 29.43,76.52 R7.1
N$10
  Top 0.61: Q1.G 32.14,52.02 R8.1
N$12
  Top 0.61: 1.4 42.52,27.62 43,28.1 43,34.1 40.65,36.45 11.7,36.45 9.1,39.05 9.1,77.6 10.2,78.7 22.5,78.7 23,78.2 23,57.1 24.3,55.8 26.98,55.8 R8.2
N$13
  Top 0.61: 1.7 37.59,25.09 37.8,25.3 37.8,33.8 10.7,33.8 6.5,38 6.5,79.3 8.4,81.2 24.49,81.2 R7.2
N$14
  Top 1.016: ZENER_2.C 40.83,19.2 D3.A 44.01,20.8 C10.2
N$15
  Top 1.016: Q3.G 54.13,53.03 R10.1
N$16
  Top 1.016: Q2.G R9.1
N$17  (via drill 0.6)
  Top 0.61: R10.2 53.89,56.1 65.2,56.1 65.2,34.1 v65.1,34 | 2.4 65.28,29.18 65.6,29.5 v65.6,29.9
  Bottom 0.61: v65.1,34 65.1,30.4 v65.6,29.9
N$18
  Top 0.61: 2.7 60.15,26.64 60.7,27.2 60.7,31.4 67.7,31.4 67.7,80.3 67.3,80.7 54.4,80.7 53.39,79.69 R9.2
N$19  (1 unrouted)
N$20
  Top 1.016: D6.A 65.53,21.48 65.53,19.25 ZENER_1.C 64.45,17.73 C13.2
N$21  (1 unrouted)
N$22
  Top 4: FUSE.1 16.03,74.52 MAIN.1
  pour Top: 11.2,65.8 22.2,65.8 22.3,65.9 22.3,78 13.2,78 11.1,78 10.9,77.8 10.9,66.1
N$45
  Bottom 0.6: 1A.C 47.63,71.14 1B.A 47.37,71.4 47.1,71.4 46.7,71 R34.1
NSS  (1 unrouted)
OSCIN  (2 unrouted)
OSCOUT  (2 unrouted)
PA0  (1 unrouted)
PA1  (1 unrouted)
PA6
  Top 0.61: 1.1 43.43,23.82 R4.2 45.5,23.2 47.2,21.5 47.2,15.3 49.5,13 49.5,7.65 M1B.2 52.1,4.95 50.41,3.26 9.54,3.26 7.76,5.04 PINHEADER.2
PA7
  Top 0.61: 2.1 65.88,25.38 R3.2 67.5,24.6 67.5,9.05 M1A.2 60.44,1.99 5.47,1.99 5.46,2 PINHEADER.1
PA11  (1 unrouted)
PA12  (2 unrouted)
PB12  (1 unrouted)
PB13  (1 unrouted)
PC13  (1 unrouted)
RESET  (3 unrouted)
RX  (1 unrouted)
SCK  (1 unrouted)
SCL1  (2 unrouted)
SCL2  (2 unrouted)
SDA1  (2 unrouted)
SDA2  (2 unrouted)
SWCLK  (1 unrouted)
SWIO  (1 unrouted)
TIMER  (via drill 0.6)
  Top 0.6: C10.1 45.22,13.8 v45.3,13.8 44.7,13.8 42.82,11.93 | C13.1 60.55,15.32 52.32,15.32 v52.3,15.3
  Top 0.61: TIMER_555.3 42.82,11.93
  Bottom 0.6: v52.3,15.3 46.8,15.3 v45.3,13.8
TX  (1 unrouted)
VB1
  Top 0.61: 1.8 35.41,23.55 C8.1
  Top 1.016: D1.C 31.52,20.05 D3.C 32.11,20.96 C8.1
VB2
  Top 0.61: 2.8 55.52,25.38 C11.1
  Top 1.016: C11.1 55.09,21.5 D6.C 53.05,21.52 D5.C
VCC  (via drill 0.6)
  Top 0.61: 2.5 57.63,29.18 56.16,30.66 | 56.16,30.66 C12.1 | 56.15,30.65 56.16,30.66 | 1.5 35.57,27.73 34.27,27.73 33,29 C9.1 | v35.3,30 33.25,30 32.96,29.71 | D5.A 51.77,30.4 v49.5,30.4 49.5,26.8 48.5,25.8 48.5,16.4 51.4,13.5 57.31,13.5 R20.1 | TIMER_555.4 41.07,13.23 39.63,13.23 39.4,13 | 39.4,13 38.9,12.51 38.9,9.8 38.49,9.38 TIMER_555.8 35.43,8.91 R2.1 35.47,6.8 C22.1 | 39.4,13 36.7,15.7 36.7,19.6 v38.4,21.3
  Top 1.016: D5.A 56.15,30.65 | D1.A 29.01,30.01 | 32.96,29.71 32.26,29.71 | 32.26,29.71 29.31,29.71 D1.A | 32.26,29.71 C9.1 | D1.A 24.9,26.3 24.9,14.2 C3.+ | 7812.OUT 15.92,8.4
  Top 1.27: 7812.OUT 16.28,8.7 C15.2 21.6,10.84 | 21.6,10.84 22.32,10.84 PWR.A | C3.+ 21.9,11.14 21.6,10.84
  Bottom 0.61: v49.5,30.4 49.3,30.2 38.3,30.2 | 38.3,30.2 35.5,30.2 v35.3,30 | v38.4,21.3 38.4,30.1 38.3,30.2